# Altium schematic sheet Charge Controller.SchDoc
size A; SheetNumber: 1; SheetTotal: 2
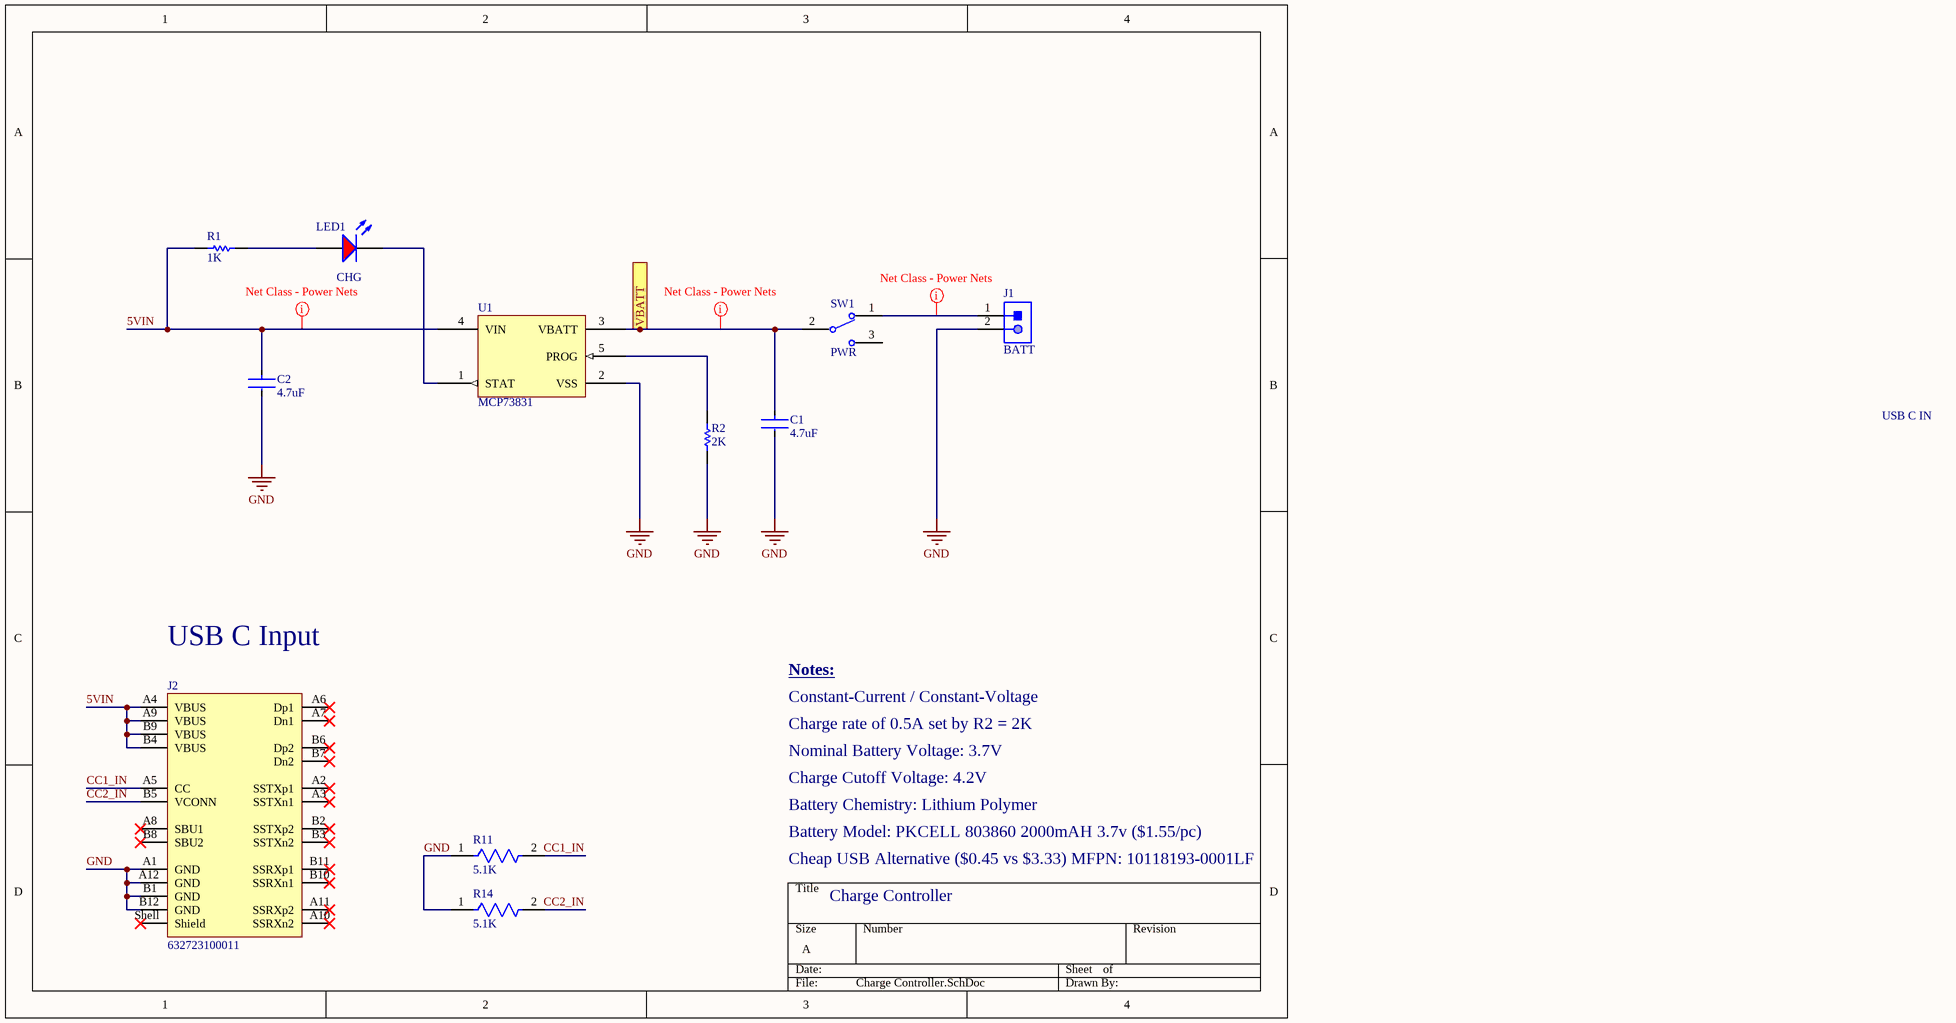
[diagram p0: Charge Controller.SchDoc]

## Parts
C1  4.7uF  [FP-C0805C475K8PACTU-MFG]
C2  4.7uF  [FP-C0805C475K8PACTU-MFG]
J1  BATT  [JST-S2B-PH-K-S_V]
J2  632723100011  [632723100011]
LED1  CHG  [WL-SMCW_0805_150080xx75000]
R1  1K  [RESC2013X60X35ML10T20]
R2  2K  [RESC2013X60X35ML10T20]
R11  5.1K  [FP-CRCW0805-e3-MFG]
R14  5.1K  [FP-CRCW0805-e3-MFG]
SW1  PWR  [FP-JS102011JAQN-MFG]
U1  MCP73831  [SOT95P280X145-5N]

## Ports
VBATT (see Step-Up DCDC Converter[1A])

## Nets
GND: C1.2 C2.2 J1.2 J2.A1(GND) J2.A12(GND) J2.B1(GND) J2.B12(GND) R2.1 R11.1 R14.1 U1.2(VSS)
5VIN: C2.1 J2.A4(VBUS) J2.A9(VBUS) J2.B4(VBUS) J2.B9(VBUS) R1.1 U1.4(VIN)
CC1_IN: J2.A5(CC) R11.2
CC2_IN: J2.B5(VCONN) R14.2
VBATT: C1.1 SW1.2(C) U1.3(VBATT) ; port VBATT
NetJ1_1: J1.1 SW1.1
NetLED1_1: LED1.1(K) U1.1(STAT)
NetLED1_2: LED1.2(A) R1.2
NetR2_2: R2.2 U1.5(PROG)

Not connected (* = marked no-connect by the designer): J2 A2(SSTXp1)* A3(SSTXn1)* A6(Dp1)* A7(Dn1)* A8(SBU1)* A10(SSRXn2)* A11(SSRXp2)* B2(SSTXp2)* B3(SSTXn2)* B6(Dp2)* B7(Dn2)* B8(SBU2)* B10(SSRXn1)* B11(SSRXp1)* Shell(Shield)*; SW1 3

## Layout directives
net class PowerNets: 5VIN, NetJ1_1, VBATT

## Notes on the sheet
- USB C IN
- USB C Input
- Notes:
- Constant-Current / Constant-Voltage
- Charge rate of 0.5A set by R2 = 2K
- Nominal Battery Voltage: 3.7V
- Charge Cutoff Voltage: 4.2V
- Battery Chemistry: Lithium Polymer
- Battery Model: PKCELL 803860 2000mAH 3.7v ($1.55/pc)
- Cheap USB Alternative ($0.45 vs $3.33) MFPN: 10118193-0001LF
- Charge Controller

## Library data of the parts
C1 C2 = CMP-2007-01007-2: CAP CER 4.7UF 10V X5R 0805; Dielectric Material: Ceramic; Dissipation Factor: 5%; Tolerance: 10%; Lead Pitch: 0.75mm; Mount: Surface Mount; Voltage Rating (DC): 10V; Length: 2mm; Case Code (Imperial): 0805; Height: 1.25mm; Package Quantity: 1; Thickness: 0.055inch; Depth: 1.25mm; Case Code (Metric): 2012; Termination: SMD/SMT; Construction: Flat; Dielectric: X5R; Series: C; Capacitance: 4.7uF; Width: 1.2mm; Max Operating Temperature: 85°C; Packaging: Tape and Reel; Voltage Rating: 10V; REACH SVHC: No SVHC; Min Operating Temperature: -55°C; Number of Pins: 2; Case/Package: 0805; Radiation Hardening: No; Lead Free: Lead Free; Voltage: 10V; RoHS Compliant: Yes
J1 = CMP-1755-00004-1: Male Header, Pitch 2 mm, 1 x 2 Position, Height 4.8 mm, Tail Length 3.4 mm, -25 to 85 degC, RoHS, Bulk; Case\Package: Radial; Tolerance: 20%; Capacitance: 10 uF; Voltage Rating (DC): 50 V; Packaging: Bulk; ComponentLink1URL: http://www.jst-mfg.com/product/pdf/eng/ePH.pdf; Radiation Hardening: No; Height: 11 mm; Package Quantity: 200; PackageDescription: Male Header, Pitch 2 mm, 1 x 2 Position, Height 4.8 mm, Tail Length 3.4 mm; PackageReference: S2B-PH-K-S; Diameter: 5 mm; Pins: 2; Mount: Through Hole; Max Operating Temperature: 85 degC; Min Operating Temperature: -40 degC; ComponentLink1Description: Datasheet; DatasheetVersion: Dec-12; Length: 11 mm; Lead Pitch: 2 mm; REACH SVHC: No SVHC; Voltage Rating: 50 V; RoHSCompliant: true
J2 = CMP-1502-03213-4: USB Connector, 24 Contact(s), Female, Right Angle, Solder and Surface Mount Terminal, Receptacle; Number of Contacts: 24; Voltage Rating: 20V; Contact Resistance: 30mΩ; Current Rating: 5A; USB Standard: USB 3.1; Insulation Resistance: 1GΩ; Pin Length: 1.5mm; Gender: Receptacle; Connector Type: USB; Min Operating Temperature: -40°C; Orientation: Horizontal; Mount: Surface Mount, Through Hole; Contact Material: Gold, Nickel; Packaging: Tape and Reel; Number of Pins: 24; Height: 3.16mm; RoHS: Compliant; Max Operating Temperature: 105°C
LED1 = CMP-1426-00011-4: LED Uni-Color Red 630nm 2-Pin Chip 0805(2012Metric) T/R; Manufacturer Lifecycle Status: ACTIVE; Luminous Intensity: 150mcd; Viewing Angle: 140°; Dominant Wavelength: 625nm; Forward Voltage: 2V; Max Reverse Voltage (DC): 5V; Lens Style: Clear, Rectangular; Forward Current: 100mA; Test Current: 20mA; Max Junction Temperature (Tj): 95°C; Power Dissipation: 72mW; YEOL: 1 = Estimated lifetime > 10 years; Lifecycle Status: Production; Color: Red; Height: 700µm; RoHS: Compliant; Width: 1.25mm; Min Operating Temperature: -40°C; Wavelength: 625nm; Mount: Surface Mount; Max Operating Temperature: 85°C; Peak Wavelength: 630nm; Case Code (Imperial): 0805; Manufacturer Package Identifier: 0805 (2012 metric); Length: 2mm; REACH SVHC: Unknown; Case/Package: 0805; Packaging: Tape and Reel; Case Code (Metric): 2012
R1 = CMP-2100-03671-1: Chip Resistor, 1 KOhm, +/- 1%, 125 mW, -55 to 155 degC, 0805 (2012 Metric), RoHS, Tape and Reel; Manufacturer: Yageo; Temperature Coefficient: 100ppm/degreesC; Voltage Rating (DC): 150V; Max Power Dissipation: 125mW; Resistance: 1KOhm; Number of Pins: 2; Number of Terminations: 2; Datasheet URL: http://www.yageo.com/NewPortal/yageodocoutput?fileName=/pdf/R-Chip/PYu-RC_Group_51_RoHS_L_5.pdf; Length: 0.079inch; Package Description: 2-Pin Surface Mounted Device, Body 2 x 1.25 mm; Depth: 1.25mm; Height: 0.024inch; Military Standard: Not; Case/Package: 0805; Package Reference: 0805; RoHSCompliant: true; Lead Free: LeadFree; Packaging: TapeandReel; Package Quantity: 1; Datasheet Version: Rev. 5, 10/2016; Tolerance: 1%; Min Operating Temperature: -55degC; Voltage Rating: 150V; Composition: ThickFilm; Case Code (Imperial): 0805; Power Rating: 125mW; Width: 0.049inch; Case Code (Metric): 2012; Manufacturer URL: http://www.yageo.com/; Max Operating Temperature: 155degC; REACH SVHC: Unknown; Termination: SMD/SMT
R2 = CMP-2001-01361-1: Manufacturer: Yageo; Part Number: RC0805JR-072KL
R11 R14 = CMP-2001-04024-2: RES Thick Film, 5.1kΩ, 1%, 0.125W, 100ppm/°C, 0805; Power Rating: 125mW; Voltage Rating (DC): 150V; Resistance: 5.1kR; Packaging: Tape and Reel; Case Code (Metric): 2012; Contact Plating: Tin; Case Code (Imperial): 0805; Depth: 1.25mm; Tolerance: 1%; Width: 0.049inch; Temperature Coefficient: 100ppm/°C; Max Power Dissipation: 125mW; Military Standard: Not; Lead Free: Lead Free; Mount: Surface Mount; Min Operating Temperature: -55°C; Package Quantity: 10; Weight: 0.000194oz; Height: 0.45mm; Number of Terminations: 2; Max Operating Temperature: 155°C; Termination: SMD/SMT; Case/Package: 0805; Composition: Thick Film; Voltage Rating: 150V; Length: 2mm; Features: Automotive AEC-Q200; Radiation Hardening: No
SW1 = CMP-10038-000001-1: SWITCH SLIDE SPDT 300MA 6V; Manufacturer: C&K; Manufacturer Part Number: JS102011JAQN; Contact Resistance: 70mΩ; Description: Slide Switch SPDT Surface Mount, Right Angle; Electromechanical Life: 5000Cycles; Device Class L2: Switches; Temperature Range Low: -40°C; Device Class L1: Electromechanical; RoHS: TRUE; Automotive: No; Throw Configuration: SPDT; Height: 3.5mm; Digikey Description: SWITCH SLIDE SPDT 300MA 6V; Device Class L3: Slide Switches; Temperature Range High: +85°C; Mouser Description: JS Series Sub-Miniature Slide Switch SPDT Right-Angle SMT; Mount: Surface Mount; ComponentLink2Description: Datasheet; Octopart: https://octopart.com/js102011jaqn-c%26k+components-74831566; Category: Switch; Contact Current Rating: 300mA; Temperature: -40°C to +85°C; Voltage Rating Dc: 6V; ComponentLink2URL: https://www.ckswitches.com/media/1422/js.pdf; Lead Free: Yes; Package: JS102011JAQN
U1 = MCP73831: MCP73831 Series Single-Cell Li-Ion/Li-Polymer Battery Charge Controller SOT-23-5; Manufacturer: Microchip; Manufacturer Part Number: MCP73831T-2ACI/OT; Manufacturer Lifecycle Status: REL; Drain to Source Resistance: 350mΩ; Max Charge Current: 500mA; Max Supply Voltage: 6V; Max Junction Temperature (Tj): 125°C; Max Output Voltage: 4.5V; Max Power Dissipation: 1.54W; Min Output Voltage: 4.168V; Min Supply Voltage: 3.75V; Number of Cells: 1; Output Voltage: 4.2V; Voltage Rating: 4.534V; Supplier: Avnet; Supplier Part Number: MCP73831T-2ACI/OT; RoHS: Compliant; Category: Battery Management; Stock: 21000; Pricing: 3000=0.66216, 6000=0.64901, 12000=0.63969, 24000=0.63063, 48000=0.6125 (USD); Projected EOL Date: 2034-11-03; Ambient Temperature Range High: 85°C; Case/Package: SOT-23; Contact Plating: Tin; Country of Assembly: Thailand; Country of Fabrication: United States of America; Country of Origin: Thailand; Export Control Classification Number (ECCN) Code: EAR99; Height: 1.45mm; HS Code: 8542.39.0090; Harmonized Tariff Schedule (HTS) Code: 8542.39.0060; Introduction Date: 2005-11-03; Length: 3.0988mm; Lifecycle Status: Production; Max Operating Temperature: 85°C; Min Operating Temperature: -40°C; Mounting Technology: Surface Mount; Nominal Supply Voltage: 6V; Number of Channels: 1; Number of Outputs: 1; Pins: 5; Output Current: 500mA; Packaging: Cut Tape; Radiation Hardening: No; REACH SVHC: Unaffected; Schedule B: 8542390000, 8542390000|8542390000|8542390000|8542390000|8542390000; Termination: SMD/SMT; Weight: 200.998119mg; Width: 1.8034mm; ComponentLink1URL: https://datasheet.octopart.com:443/MCP73831T-2ACI-OT-Microchip-datasheet-8814540.pdf?src-supplier=element14+APAC; ComponentLink1Description: https://datasheet.octopart.com:443/MCP73831T-2ACI-OT-Microchip-datasheet-8814540.pdf?src-supplier=element14+APAC; ComponentLink2URL: https://datasheet.octopart.com:443/MCP73831T-2ACI-OT-Microchip-datasheet-145017548.pdf?src-supplier=Microchip; ComponentLink2Description: https://datasheet.octopart.com:443/MCP73831T-2ACI-OT-Microchip-datasheet-145017548.pdf?src-supplier=Microchip; ComponentLink3URL: https://datasheet.octopart.com:443/MCP73831T-2ACI-OT-Microchip-datasheet-34193478.pdf?src-supplier=Farnell; ComponentLink3Description: https://datasheet.octopart.com:443/MCP73831T-2ACI-OT-Microchip-datasheet-34193478.pdf?src-supplier=Farnell; ComponentLink4URL: https://datasheet.octopart.com:443/MCP73831T-2ACI-OT-Microchip-datasheet-16123459.pdf?src-supplier=LKR; ComponentLink4Description: https://datasheet.octopart.com:443/MCP73831T-2ACI-OT-Microchip-datasheet-16123459.pdf?src-supplier=LKR; ComponentLink5URL: https://datasheet.octopart.com:443/MCP73831T-2ACI-OT-Microchip-datasheet-142675560.pdf?src-supplier=TME; ComponentLink5Description: https://datasheet.octopart.com:443/MCP73831T-2ACI-OT-Microchip-datasheet-142675560.pdf?src-supplier=TME; ComponentLink6URL: https://datasheet.octopart.com:443/MCP73831T-2ACI-OT-Microchip-datasheet-158592061.pdf?src-supplier=SHENGYU+ELECTRONICS; ComponentLink6Description: https://datasheet.octopart.com:443/MCP73831T-2ACI-OT-Microchip-datasheet-158592061.pdf?src-supplier=SHENGYU+ELECTRONICS; ComponentLink7URL: https://datasheet.octopart.com/MCP73831T-2ACI-OT-Microchip-datasheet-16593012.pdf; ComponentLink7Description: https://datasheet.octopart.com/MCP73831T-2ACI-OT-Microchip-datasheet-16593012.pdf; ComponentLink8URL: https://datasheet.octopart.com:443/MCP73831T-2ACI-OT-Microchip-datasheet-7127743.pdf?src-supplier=Newark; ComponentLink8Description: https://datasheet.octopart.com:443/MCP73831T-2ACI-OT-Microchip-datasheet-7127743.pdf?src-supplier=Newark; ComponentLink9URL: https://datasheet.octopart.com:443/MCP73831T-2ACIOT-Microchip-datasheet-39874.pdf?src-supplier=RS+(Formerly+Allied+Electronics); ComponentLink9Description: https://datasheet.octopart.com:443/MCP73831T-2ACIOT-Microchip-datasheet-39874.pdf?src-supplier=RS+(Formerly+Allied+Electronics); ComponentLink10URL: http://sigma.octopart.com:80/188449423/materials_sheet/Microchip-MCP73831T-2ACI-OT.pdf?src-supplier=Compliance+Statements; ComponentLink10Description: http://sigma.octopart.com:80/188449423/materials_sheet/Microchip-MCP73831T-2ACI-OT.pdf?src-supplier=Compliance+Statements; ComponentLink11URL: http://sigma.octopart.com:80/192856963/materials_sheet/Microchip-MCP73831T-2ACI-OT.pdf?src-supplier=Compliance+Statements; ComponentLink11Description: http://sigma.octopart.com:80/192856963/materials_sheet/Microchip-MCP73831T-2ACI-OT.pdf?src-supplier=Compliance+Statements; ComponentLink12URL: http://sigma.octopart.com:80/rohs_statement/Microchip-company-71.pdf?src-supplier=Compliance+Statements; ComponentLink12Description: http://sigma.octopart.com:80/rohs_statement/Microchip-company-71.pdf?src-supplier=Compliance+Statements; ComponentLink13URL: http://sigma.octopart.com:80/reach_statement/Microchip-company-70.pdf?src-supplier=Compliance+Statements; ComponentLink13Description: http://sigma.octopart.com:80/reach_statement/Microchip-company-70.pdf?src-supplier=Compliance+Statements; ComponentLink14URL: http://sigma.octopart.com:80/conflict_mineral_statement/Microchip-company-69.pdf?src-supplier=Compliance+Statements; ComponentLink14Description: http://sigma.octopart.com:80/conflict_mineral_statement/Microchip-company-69.pdf?src-supplier=Compliance+Statements; ComponentLink15URL: http://sigma.octopart.com:80/conflict_mineral_statement/Microchip-company-68.pdf?src-supplier=Compliance+Statements; ComponentLink15Description: http://sigma.octopart.com:80/conflict_mineral_statement/Microchip-company-68.pdf?src-supplier=Compliance+Statements